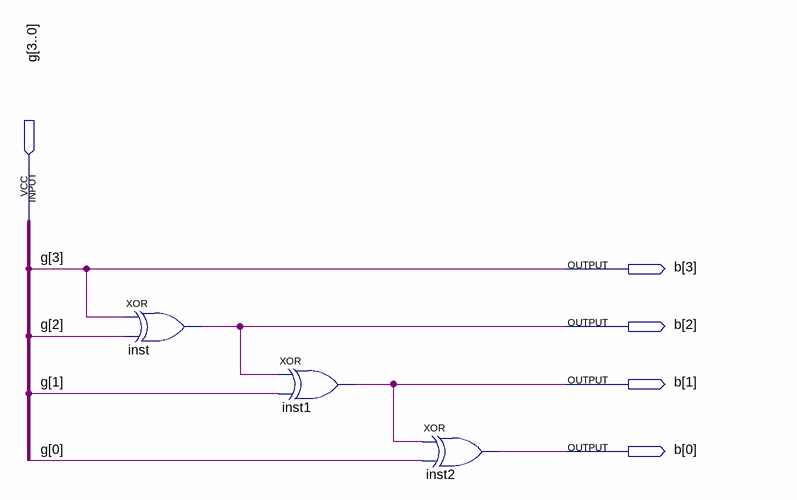
[diagram p0: schematic sheet]
// Quartus schematic lab3.bdf as structural Verilog: 3 symbols, 5 pins
module lab3 (
  input  [3:0] g,
  output [3:0] b
);

  xor inst (b[2], g[3], g[2]);
  xor inst1 (b[1], b[2], g[1]);
  xor inst2 (b[0], b[1], g[0]);

  assign b[3] = g[3];
endmodule
